# Altium schematic sheet FPGA _RAM.SchDoc
size A4; SheetNumber: 2; SheetTotal: 5
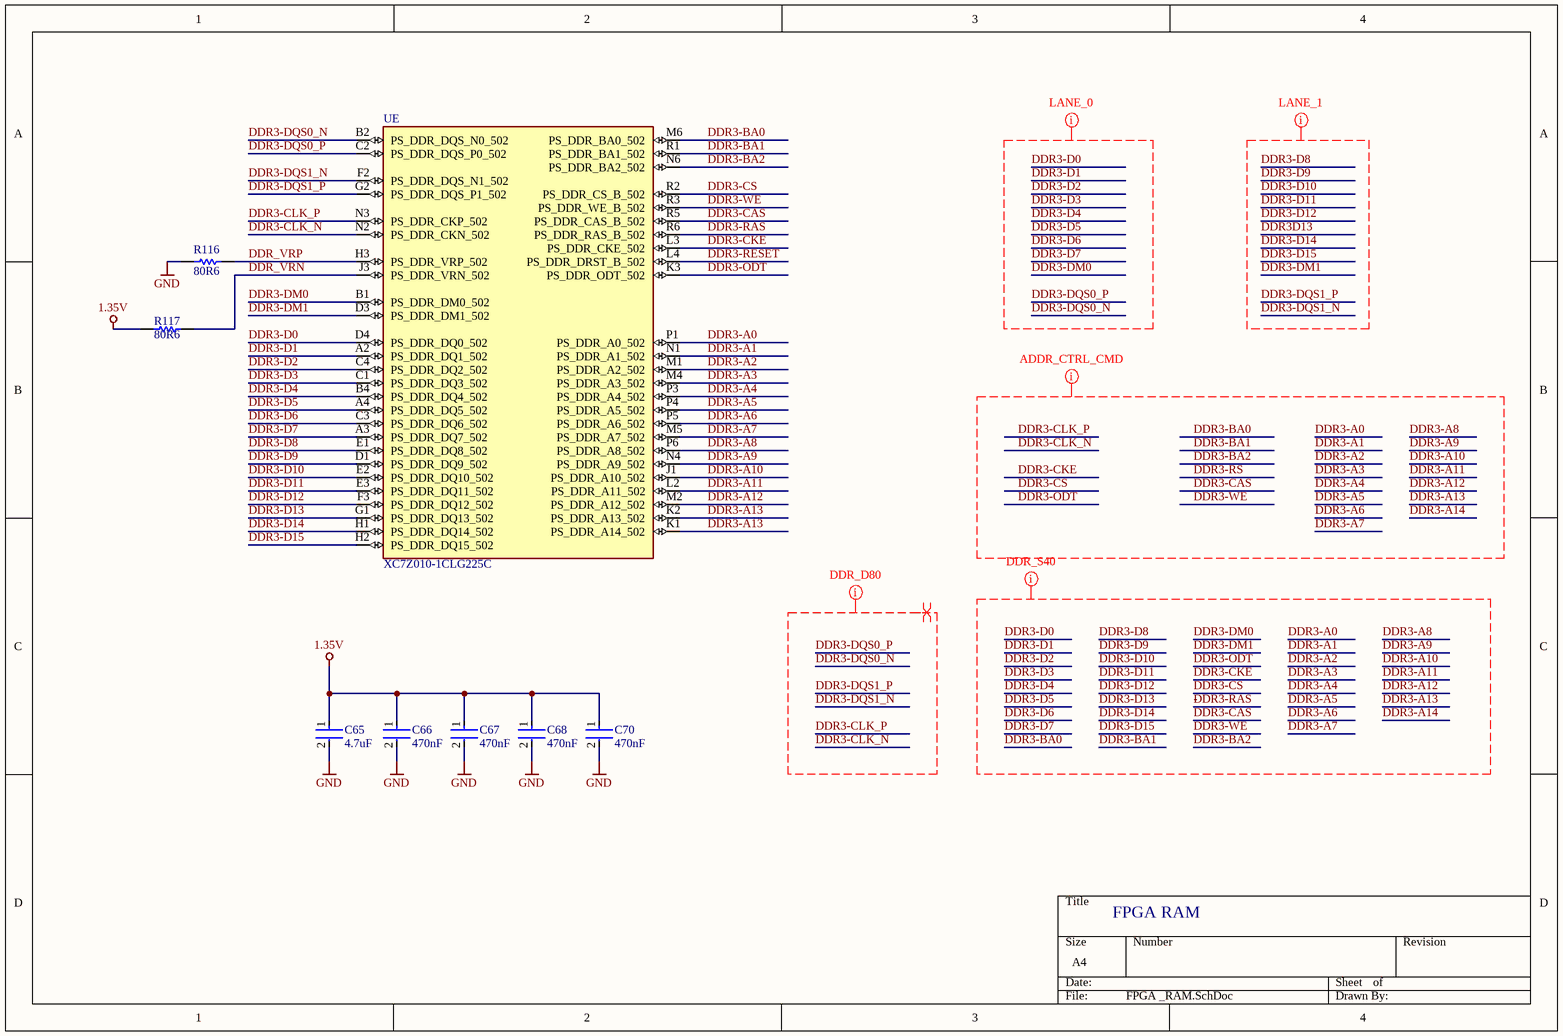
[diagram p0: FPGA _RAM.SchDoc]

## Parts
C65  4.7uF  [FP-GRM15-0_1-MFG]
C66  470nF  [FP-GRM15-0_1-MFG]
C67  470nF  [FP-GRM15-0_1-MFG]
C68  470nF  [FP-GRM15-0_1-MFG]
C70  470nF  [FP-GRM15-0_1-MFG]
R116  80R6  [RESC1005X40X25LL05T10]
R117  80R6  [RESC1005X40X25LL05T10]
U  XC7Z010-1CLG225C  [BGA225C80P15X15_1300X1300X150]  (part E of 6)

## Nets
1.35V: C65.1 C66.1 C67.1 C68.1 C70.1 R117.1
GND: C65.2 C66.2 C67.2 C68.2 C70.2 R116.1
-: U.R6(PS_DDR_RAS_B_502)  [also labelled DDR3-RAS]
DDR3-A0: U.P1(PS_DDR_A0_502)
DDR3-A1: U.N1(PS_DDR_A1_502)
DDR3-A2: U.M1(PS_DDR_A2_502)
DDR3-A3: U.M4(PS_DDR_A3_502)
DDR3-A4: U.P3(PS_DDR_A4_502)
DDR3-A5: U.P4(PS_DDR_A5_502)
DDR3-A6: U.P5(PS_DDR_A6_502)
DDR3-A7: U.M5(PS_DDR_A7_502)
DDR3-A8: U.P6(PS_DDR_A8_502)
DDR3-A9: U.N4(PS_DDR_A9_502)
DDR3-A10: U.J1(PS_DDR_A10_502)
DDR3-A11: U.L2(PS_DDR_A11_502)
DDR3-A12: U.M2(PS_DDR_A12_502)
DDR3-A13: U.K1(PS_DDR_A14_502) U.K2(PS_DDR_A13_502)
DDR3-BA0: U.M6(PS_DDR_BA0_502)
DDR3-BA1: U.R1(PS_DDR_BA1_502)
DDR3-BA2: U.N6(PS_DDR_BA2_502)
DDR3-CAS: U.R5(PS_DDR_CAS_B_502)
DDR3-CKE: U.L3(PS_DDR_CKE_502)
DDR3-CLK_N: U.N2(PS_DDR_CKN_502)
DDR3-CLK_P: U.N3(PS_DDR_CKP_502)
DDR3-CS: U.R2(PS_DDR_CS_B_502)
DDR3-D0: U.D4(PS_DDR_DQ0_502)
DDR3-D1: U.A2(PS_DDR_DQ1_502)
DDR3-D2: U.C4(PS_DDR_DQ2_502)
DDR3-D3: U.C1(PS_DDR_DQ3_502)
DDR3-D4: U.B4(PS_DDR_DQ4_502)
DDR3-D5: U.A4(PS_DDR_DQ5_502)
DDR3-D6: U.C3(PS_DDR_DQ6_502)
DDR3-D7: U.A3(PS_DDR_DQ7_502)
DDR3-D8: U.E1(PS_DDR_DQ8_502)
DDR3-D9: U.D1(PS_DDR_DQ9_502)
DDR3-D10: U.E2(PS_DDR_DQ10_502)
DDR3-D11: U.E3(PS_DDR_DQ11_502)
DDR3-D12: U.F3(PS_DDR_DQ12_502)
DDR3-D13: U.G1(PS_DDR_DQ13_502)
DDR3-D14: U.H1(PS_DDR_DQ14_502)
DDR3-D15: U.H2(PS_DDR_DQ15_502)
DDR3-DM0: U.B1(PS_DDR_DM0_502)
DDR3-DM1: U.D3(PS_DDR_DM1_502)
DDR3-DQS0_N: U.B2(PS_DDR_DQS_N0_502)
DDR3-DQS0_P: U.C2(PS_DDR_DQS_P0_502)
DDR3-DQS1_N: U.F2(PS_DDR_DQS_N1_502)
DDR3-DQS1_P: U.G2(PS_DDR_DQS_P1_502)
DDR3-ODT: U.K3(PS_DDR_ODT_502)
DDR3-RESET: U.L4(PS_DDR_DRST_B_502)
DDR3-WE: U.R3(PS_DDR_WE_B_502)
DDR_VRN: R117.2 U.J3(PS_DDR_VRN_502)
DDR_VRP: R116.2 U.H3(PS_DDR_VRP_502)

## Layout directives
mark named LANE_0: DDR3-D0, DDR3-D1, DDR3-D2, DDR3-D3, DDR3-D4, DDR3-D5, DDR3-D6, DDR3-D7, DDR3-DM0, DDR3-DQS0_N, DDR3-DQS0_P
mark named LANE_1: DDR3-D8, DDR3-D9, DDR3-D10, DDR3-D11, DDR3-D12, DDR3-D14, DDR3-D15, DDR3-DM1, DDR3-DQS1_N, DDR3-DQS1_P, DDR3D13
mark named ADDR_CTRL_CMD: DDR3-A0, DDR3-A1, DDR3-A2, DDR3-A3, DDR3-A4, DDR3-A5, DDR3-A6, DDR3-A7, DDR3-A8, DDR3-A9, DDR3-A10, DDR3-A11, DDR3-A12, DDR3-A13, DDR3-A14, DDR3-BA0, DDR3-BA1, DDR3-BA2, DDR3-CAS, DDR3-CKE, DDR3-CLK_N, DDR3-CLK_P, DDR3-CS, DDR3-ODT, DDR3-RS, DDR3-WE
mark named DDR_S40: -, DDR3-A0, DDR3-A1, DDR3-A2, DDR3-A3, DDR3-A4, DDR3-A5, DDR3-A6, DDR3-A7, DDR3-A8, DDR3-A9, DDR3-A10, DDR3-A11, DDR3-A12, DDR3-A13, DDR3-A14, DDR3-BA0, DDR3-BA1, DDR3-BA2, DDR3-CAS, DDR3-CKE, DDR3-CS, DDR3-D0, DDR3-D1, DDR3-D2, DDR3-D3, DDR3-D4, DDR3-D5, DDR3-D6, DDR3-D7, DDR3-D8, DDR3-D9, DDR3-D10, DDR3-D11, DDR3-D12, DDR3-D13, DDR3-D14, DDR3-D15, DDR3-DM0, DDR3-DM1, DDR3-ODT, DDR3-RAS, DDR3-WE
mark named DDR_D80: DDR3-CLK_N, DDR3-CLK_P, DDR3-DQS0_N, DDR3-DQS0_P, DDR3-DQS1_N, DDR3-DQS1_P
differential pair: DDR3-CLK_N, DDR3-CLK_P, DDR3-DQS0_N, DDR3-DQS0_P, DDR3-DQS1_N, DDR3-DQS1_P

## Notes on the sheet
- FPGA RAM

## Library data of the parts
C65-C68 C70 = CMP-2000-05009-2: CAP CER 0.47UF 10V X5R 0402; Manufacturer: Murata Electronics North America; Manufacturer Part Number: GRM155R61A474KE15D; Temperature Coefficient: 15%; Material: Ceramic; Tolerance: 10%; Device Class L3: Ceramic Capacitors; ComponentLink2Description: Datasheet; ComponentLink2URL: https://search.murata.co.jp/Ceramy/image/img/A01X/G101/ENG/GRM155R61A474KE15-01A.pdf; Package: GRM15-0.1; Voltage Rating: 10V; Capacitance: 0.47uF; Category: Cap; Temperature Range High: +85°C; Temperature Range Low: -55°C; Height: 0.55mm; Device Class L2: Capacitors; Lead Free: Yes; Mouser Description: Multilayer Ceramic Capacitors MLCC - SMD/SMT 0402 0.47uF 10volts X5R 10%; Ipc Land Pattern Name: CAPC10050X50; Temperature Characteristic: X5R; Digikey Description: CAP CER 0.47UF 10V X5R 0402; Value: 0.47uF; Octopart: https://octopart.com/grm155r61a474ke15d-murata-196883; Automotive: No; Device Class L1: Passive Components; Temperature: -55°C to +85°C; RoHS: TRUE
R116 R117 = CMP-1011-00386-2: Manufacturer: Yageo; Part Number: RC0402FR-0780R6L
U = XC7Z010-1CLG225C: Dual ARMÂ® CortexÂ®-A9 MPCoreâ„¢ with CoreSightâ„¢ System On Chip _SOC_ IC ZynqÂ®-7000 Artixâ„¢-7 FPGA, 28K Logic Cells 667MHz 225-CSPBGA _13x13_; MF: Xilinx Inc.; Value: *; SnapEDA_Link: https://www.snapeda.com/parts/XC7Z010-1CLG225C/Xilinx%20Inc./view-part/45778/?ref=snap; Digi-Key_Part_Number: 122-1855-ND; Package: CSPBGA-225 Xilinx; Digi-Key_Purchase_URL: https://www.digikey.by/product-detail/en/xilinx-inc/XC7Z010-1CLG225C/122-1855-ND/3925788?utm_source=snapeda&utm_medium=aggregator&utm_campaign=symbol; MP: XC7Z010-1CLG225C